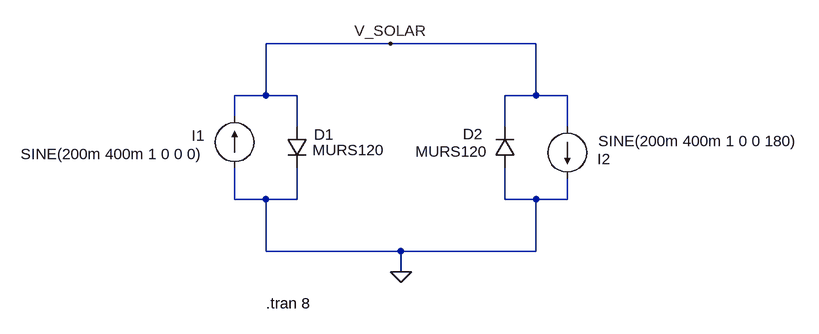
[diagram p0: schematic pendulum.asc]
pendulum.asc, the LTspice schematic file:
Version 4
SHEET 1 1056 680
WIRE 400 32 208 32
WIRE 624 32 400 32
WIRE 208 112 208 32
WIRE 208 112 160 112
WIRE 256 112 208 112
WIRE 624 112 624 32
WIRE 624 112 576 112
WIRE 672 112 624 112
WIRE 160 144 160 112
WIRE 256 160 256 112
WIRE 576 160 576 112
WIRE 672 160 672 112
WIRE 160 272 160 224
WIRE 208 272 160 272
WIRE 256 272 256 224
WIRE 256 272 208 272
WIRE 576 272 576 224
WIRE 624 272 576 272
WIRE 672 272 672 240
WIRE 672 272 624 272
WIRE 208 352 208 272
WIRE 416 352 208 352
WIRE 624 352 624 272
WIRE 624 352 416 352
WIRE 416 384 416 352
FLAG 416 384 0
FLAG 400 32 V_SOLAR
SYMBOL current 160 224 R180
WINDOW 0 46 50 Left 2
WINDOW 3 48 22 Left 2
WINDOW 123 0 0 Left 0
WINDOW 39 0 0 Left 0
SYMATTR InstName I1
SYMATTR Value SINE(200m 400m 1 0 0 0)
SYMBOL diode 240 160 R0
WINDOW 0 42 12 Left 2
WINDOW 3 40 36 Left 2
SYMATTR InstName D1
SYMATTR Value MURS120
SYMBOL current 672 160 R0
WINDOW 0 46 50 Left 2
WINDOW 3 48 22 Left 2
WINDOW 123 0 0 Left 0
WINDOW 39 0 0 Left 0
SYMATTR InstName I2
SYMATTR Value SINE(200m 400m 1 0 0 180)
SYMBOL diode 592 224 R180
WINDOW 0 50 53 Left 2
WINDOW 3 43 26 Left 2
SYMATTR InstName D2
SYMATTR Value MURS120
TEXT 208 432 Left 2 !.tran 8

The netlist it stands for:
* pendulum.asc
I1 0 V_SOLAR SINE(200m 400m 1 0 0 0)
D1 V_SOLAR 0 MURS120
I2 V_SOLAR 0 SINE(200m 400m 1 0 0 180)
D2 0 V_SOLAR MURS120
.model D D
.lib standard.dio
.tran 8
.backanno
.end